# EAGLE design Battery_Monitor_5 (EAGLE 8.3.2)
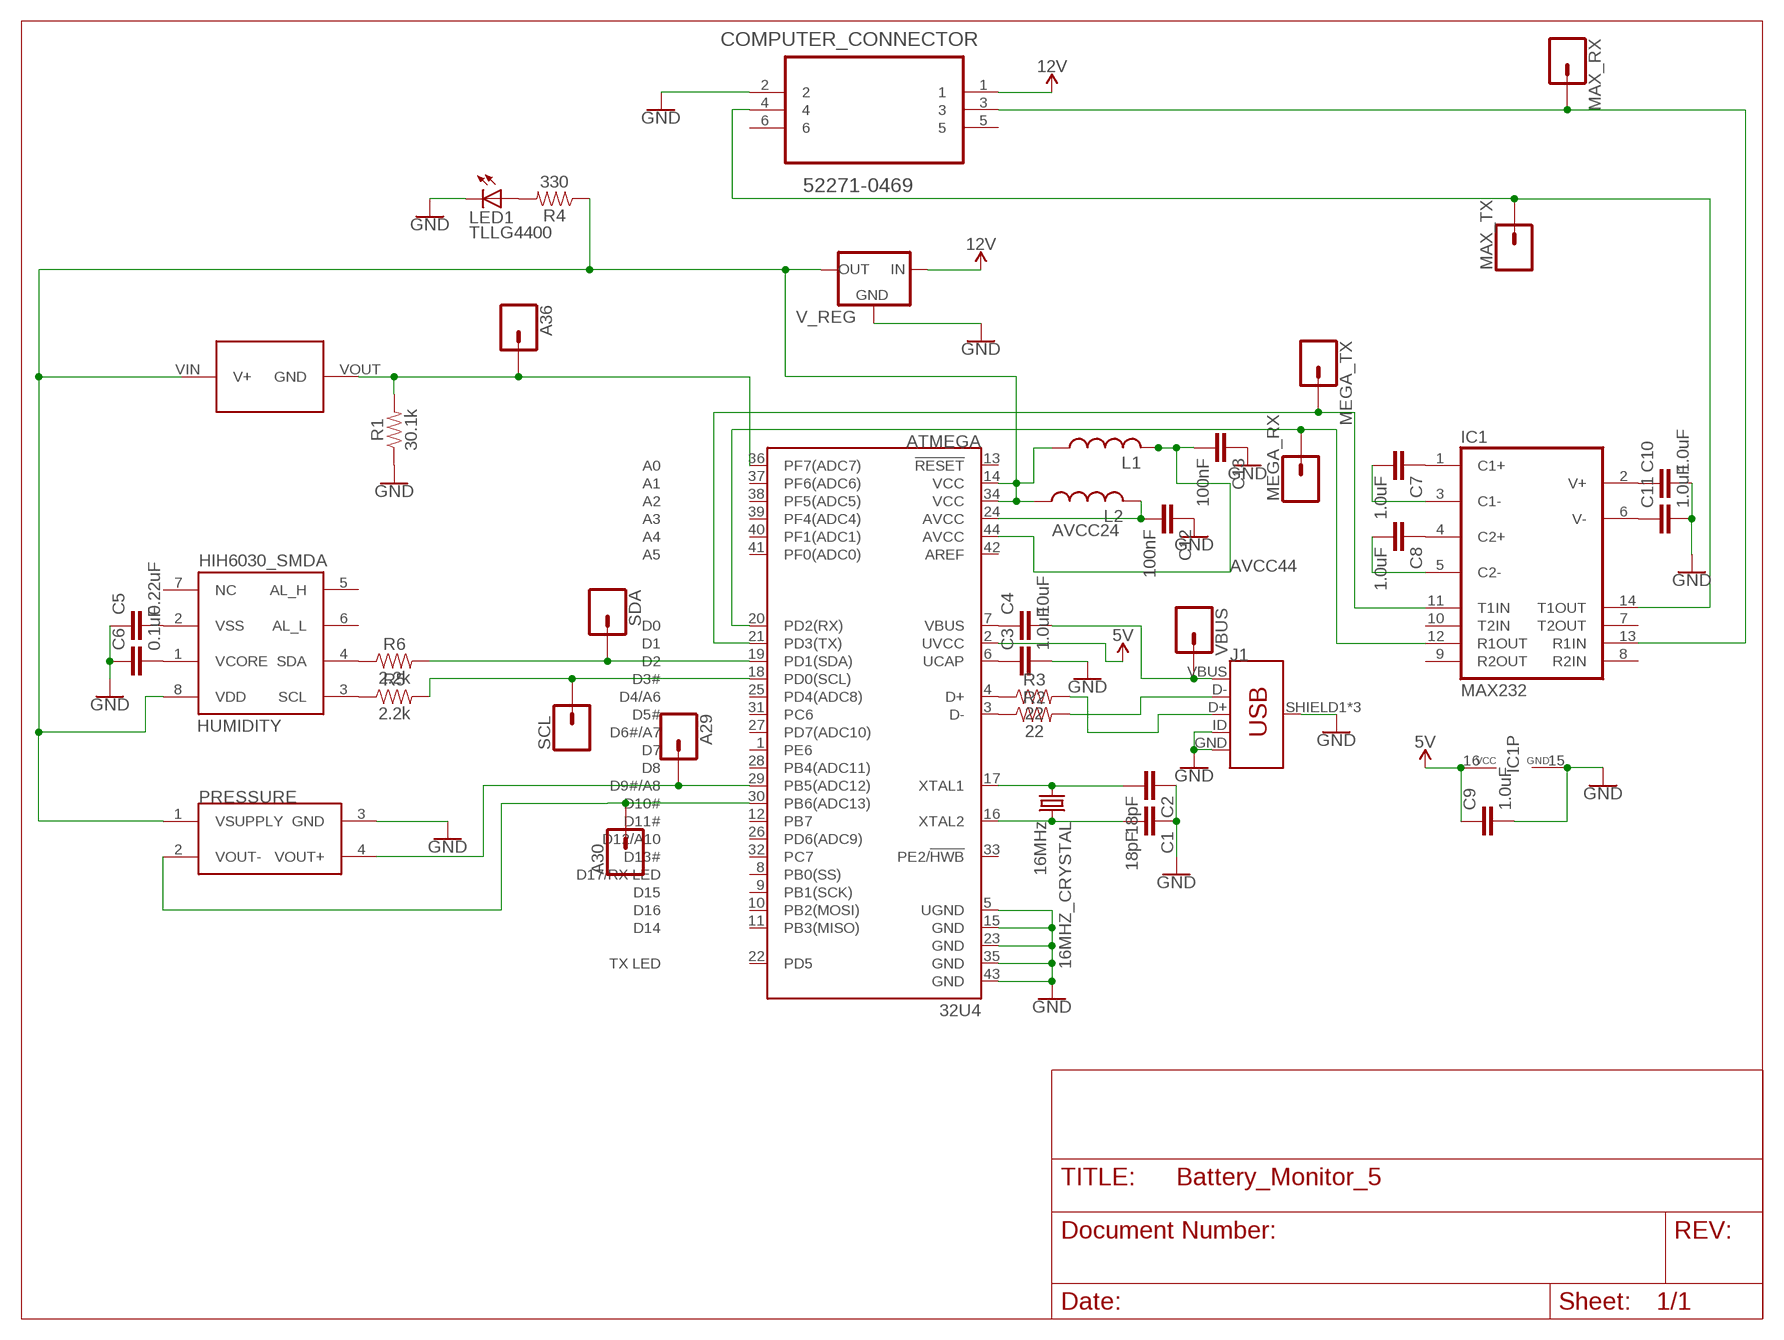
[diagram p0: schematic, sheet 1]

## Parts
16MHZ_CRYSTAL  16MHz  CRYSTALHC49S  [HC49/S]
A29  CONN_01POGOPIN_HOLE_LARGE  [1X01_POGOPIN_HOLE_0.061_DIA]
A30  CONN_01POGOPIN_HOLE_LARGE  [1X01_POGOPIN_HOLE_0.061_DIA]
A36  CONN_01POGOPIN_HOLE_LARGE  [1X01_POGOPIN_HOLE_0.061_DIA]
ATMEGA  32U4  ATMEGA32U4QFN  [QFN-44]
C1  18pF  18PF-0603-50V-5%  [0603]
C2  18pF  18PF-0603-50V-5%  [0603]
C3  1.0uF  1.0UF-0402-16V-10%  [0402]
C4  10uF  10UF-0603-6.3V-20%  [0603]
C5  0.22uF  0.22UF-0603-25V-10%  [0603]
C6  0.1uF  0.1UF-0402-16V-10%  [0402]
C7  1.0uF  1.0UF-0402-16V-10%  [0402]
C8  1.0uF  1.0UF-0402-16V-10%  [0402]
C9  1.0uF  1.0UF-0402-16V-10%  [0402]
C10  1.0uF  1.0UF-0402-16V-10%  [0402]
C11  1.0uF  1.0UF-0402-16V-10%  [0402]
C12  100nF  1.0UF-0402-16V-10%  [0402]
C13  100nF  1.0UF-0402-16V-10%  [0402]
COMPUTER_CONNECTOR  52271-0469  [MOLEX_52271-0469]
FLEX_SQ  MOLEX_2WIRE2018  [SMT_MOLEX_PKG]
HUMIDITY  HIH6030_SMDA  [SMD-8]
IC1  MAX232  [DIL16]
J1  USB_MICRO-B_FEMALE-SMT  [USB-B-MICRO-SMD]
L1  L-USL1812  [L1812]
L2  L-USL1812  [L1812]
LED1  TLLG4400  [LED3MM]
MAX_RX  CONN_01POGOPIN_HOLE_LARGE  [1X01_POGOPIN_HOLE_0.061_DIA]
MAX_TX  CONN_01POGOPIN_HOLE_LARGE  [1X01_POGOPIN_HOLE_0.061_DIA]
MEGA_RX  CONN_01POGOPIN_HOLE_LARGE  [1X01_POGOPIN_HOLE_0.061_DIA]
MEGA_TX  CONN_01POGOPIN_HOLE_LARGE  [1X01_POGOPIN_HOLE_0.061_DIA]
PRESSURE  HONEYWELL_PRESSURE_SENSOR2018  [4PIN_SMT]
R1  30.1k  30.1KOHM-0603-1/10W-1%  [0603]
R2  22  22OHM-0402-1/10W-1%  [0402]
R3  22  22OHM-0402-1/10W-1%  [0402]
R4  330  330OHM-0603-1/10W-1%  [0603]
R5  2.2k  2.2KOHM-0603-1/10W-1%  [0603]
R6  2.2k  2.2KOHM-0603-1/10W-1%  [0603]
SCL  CONN_01POGOPIN_HOLE_LARGE  [1X01_POGOPIN_HOLE_0.061_DIA]
SDA  CONN_01POGOPIN_HOLE_LARGE  [1X01_POGOPIN_HOLE_0.061_DIA]
V_REG  DC_DC_78XXA  [DC-DC_CONVERTER_78XX]
VBUS  CONN_01POGOPIN_HOLE_LARGE  [1X01_POGOPIN_HOLE_0.061_DIA]

## Nets
5V: ATMEGA.2(UVCC) ATMEGA.14(VCC) ATMEGA.34(VCC) C9.1 FLEX_SQ.VIN(V+) HUMIDITY.8(VDD) IC1.16(VCC) L1.1 L2.1 PRESSURE.1(VSUPPLY) R4.1 V_REG.VOUT(OUT)
12V: COMPUTER_CONNECTOR.1 V_REG.VIN(IN)
A29: A29.1 ATMEGA.29(PB5(ADC12)) PRESSURE.4(VOUT+)
A30: A30.1 ATMEGA.30(PB6(ADC13)) PRESSURE.2(VOUT-)
A36: A36.1 ATMEGA.36(PF7(ADC7)) FLEX_SQ.VOUT(GND) R1.2
AVCC24: ATMEGA.24(AVCC) C12.2 L2.2
AVCC44: ATMEGA.44(AVCC) C13.2 L1.2
D+: J1.D+ R3.2
D-: J1.D- R2.2
GND: ATMEGA.5(UGND) ATMEGA.15(GND) ATMEGA.23(GND) ATMEGA.35(GND) ATMEGA.43(GND) C1.1 C2.1 C3.2 C5.1 C6.1 C9.2 C10.2 C11.2 C12.1 C13.1 COMPUTER_CONNECTOR.2 IC1.15(GND) J1.GND J1.ID J1.SHIELD1(SHIELD) J1.SHIELD2(SHIELD) J1.SHIELD3(SHIELD) LED1.K(C) PRESSURE.3(GND) R1.1 V_REG.GND
MAX_RX: COMPUTER_CONNECTOR.3 IC1.13(R1IN) MAX_RX.1
MAX_TX: COMPUTER_CONNECTOR.4 IC1.14(T1OUT) MAX_TX.1
MEGA_RX: ATMEGA.20(PD2(RX)) IC1.12(R1OUT) MEGA_RX.1
MEGA_TX: ATMEGA.21(PD3(TX)) IC1.11(T1IN) MEGA_TX.1
N$3: HUMIDITY.3(SCL) R5.1
N$5: HUMIDITY.4(SDA) R6.1
N$6: C6.2 HUMIDITY.1(VCORE)
N$7: C5.2 HUMIDITY.2(VSS)
N$8: C7.1 IC1.1(C1+)
N$9: C8.1 IC1.4(C2+)
N$10: C8.2 IC1.5(C2-)
N$11: C7.2 IC1.3(C1-)
N$14: C10.1 IC1.2(V+)
N$15: C11.1 IC1.6(V-)
N$19: ATMEGA.3(D-) R2.1
N$20: ATMEGA.4(D+) R3.1
N$21: ATMEGA.6(UCAP) C3.1
N$22: ATMEGA.7(VBUS) C4.1
N$23: LED1.A R4.2
SCL: ATMEGA.18(PD0(SCL)) R5.2 SCL.1
SDA: ATMEGA.19(PD1(SDA)) R6.2 SDA.1
TAL1: 16MHZ_CRYSTAL.1 ATMEGA.17(XTAL1) C2.2
TAL2: 16MHZ_CRYSTAL.2 ATMEGA.16(XTAL2) C1.2
VBUS: C4.2 J1.VBUS VBUS.1
Unconnected: ATMEGA.1(PE6) ATMEGA.8(PB0(SS)) ATMEGA.9(PB1(SCK)) ATMEGA.10(PB2(MOSI)) ATMEGA.11(PB3(MISO)) ATMEGA.12(PB7) ATMEGA.13(!RESET) ATMEGA.22(PD5) ATMEGA.25(PD4(ADC8)) ATMEGA.26(PD6(ADC9)) ATMEGA.27(PD7(ADC10)) ATMEGA.28(PB4(ADC11)) ATMEGA.31(PC6) ATMEGA.32(PC7) ATMEGA.33(PE2/!HWB) ATMEGA.37(PF6(ADC6)) ATMEGA.38(PF5(ADC5)) ATMEGA.39(PF4(ADC4)) ATMEGA.40(PF1(ADC1)) ATMEGA.41(PF0(ADC0)) ATMEGA.42(AREF) COMPUTER_CONNECTOR.5 COMPUTER_CONNECTOR.6 HUMIDITY.5(AL_H) HUMIDITY.6(AL_L) HUMIDITY.7(NC) IC1.7(T2OUT) IC1.8(R2IN) IC1.9(R2OUT) IC1.10(T2IN)

## Library data of the parts
16MHZ_CRYSTAL = crystal:CRYSTAL: CRYSTAL; OC_FARNELL: 1667008; OC_NEWARK: unknown
A29 A30 A36 MAX_RX MAX_TX MEGA_RX MEGA_TX SCL SDA VBUS = SparkFun-Connectors:CONN_01: Single connection point. Often used as Generic Header-pin footprint for 0.1 inch spaced/style header connections On any of the 0.1 inch spaced packages, you can populate with these: Break Away Headers - Straight <https://www.sparkfun.com/products/116> (PRT-00116) Break Away Male Headers - Right Angle <https://www.sparkfun.com/products/553> (PRT-00553) Female Headers <https://www.sparkfun.com/products/115> (PRT-00115) Break Away Headers - Machine Pin <https://www.sparkfun.com/products/117> (PRT-00117) Break Away Female Headers - Swiss Machine Pin <https://www.sparkfun.com/products/743> (PRT-00743) This device is also useful as a general connection point to wire up your design to another part of your project. Our various solder wires solder well into these plated through hole pads. Hook-Up Wire - Assortment (Stranded, 22 AWG) <https://www.sparkfun.com/products/11375> (PRT-11375) Hook-Up Wire - Assortment (Solid Core, 22 AWG) <https://www.sparkfun.com/products/11367> (PRT-11367) View the entire wire category on our website here <https://www.sparkfun.com/categories/141> Special notes: SMTSO-256-ET is a "flush mount" nut for a 4-40 screw. We mostly use this on specialty testbeds; it is a nice way to connect hardware to your PCB at an adjustable hieght. Also note, the SNAP packages are for using a snappable style connector. We sell a baggie of snaps and they are also used on two LilyPad designs: Snap Assortment - 30 pack (male and female) <https://www.sparkfun.com/products/11347> (DEV-11347) LilyPad Arduino SimpleSnap <https://www.sparkfun.com/products/10941> (DEV-10941) LilyPad SimpleSnap Protoboard <https://www.sparkfun.com/products/10940> (DEV-10940)
ATMEGA = SparkFun-IC-Microcontroller:ATMEGA32U4: Atmel MCU, 32KByte Atmel 44-pin 8-bit Microcontroller with 32KBytes of ISP Flash and USB Controller Datasheet <http://cdn.sparkfun.com/datasheets/Dev/Arduino/Boards/ATMega32U4.pdf> SparkFun Products LilyPad Arduino USB - ATmega32U4 Board <https://www.sparkfun.com/products/12049> (DEV-12049) Pro Micro - 5V/16MHz <https://www.sparkfun.com/products/12640> (DEV-12640) Pro Micro - 3.3V/8MHz <https://www.sparkfun.com/products/12587> (DEV-12587) Fio v3 - ATmega32U4 <https://www.sparkfun.com/products/11520> (DEV-11520) Qduino Mini <https://www.sparkfun.com/products/13614> (DEV-13614) Makey Makey - Standard Kit <https://www.sparkfun.com/products/11511> (WIG-11511) Makey Makey Deluxe Kit <https://www.sparkfun.com/products/11519> (WIG-11519); PROD_ID: IC-10828
C1 C2 = SparkFun-Capacitors:18PF: 18pF ceramic capacitors A capacitor is a passive two-terminal electrical component used to store electrical energy temporarily in an electric field.; PROD_ID: CAP-08267
C3 C7-C11 = SparkFun-Capacitors:1.0UF: 1µF ceramic capacitors A capacitor is a passive two-terminal electrical component used to store electrical energy temporarily in an electric field.; PROD_ID: CAP-12417
C4 = SparkFun-Capacitors:10UF: 10.0µF ceramic capacitors A capacitor is a passive two-terminal electrical component used to store electrical energy temporarily in an electric field.; PROD_ID: CAP-11015
C5 = SparkFun-Capacitors:0.22UF: 0.22µF ceramic capacitors A capacitor is a passive two-terminal electrical component used to store electrical energy temporarily in an electric field.; PROD_ID: CAP-07822
C6 = SparkFun-Capacitors:0.1UF: 0.1µF ceramic capacitors A capacitor is a passive two-terminal electrical component used to store electrical energy temporarily in an electric field.; PROD_ID: CAP-12416
C12 C13 = SparkFun-Capacitors:1.0UF: 1µF ceramic capacitors A capacitor is a passive two-terminal electrical component used to store electrical energy temporarily in an electric field.; PROD_ID: CAP-12417; VALUE: 1.0uF
COMPUTER_CONNECTOR = Molex_By_element14_Batch_1 (1):52271-0469: CONNECTOR, FPC, 1.0MM, 4 WAY; MPN: 52271-0469; OC_FARNELL: 1757086; OC_NEWARK: 07P8558; PACKAGE: CONNECTOR, FPC, 1.0MM, 4 WAY; SUPPLIER: Molex
FLEX_SQ = Molex_2wire_conn:MOLEX_2WIRE
HUMIDITY = Custom_Library:HIH6030_
IC1 = maxim:MAX232: RS232 TRANSCEIVER; MF: MAXIM; MPN: MAX232ACPE+; OC_FARNELL: 9723773; OC_NEWARK: 68K4544
J1 = SparkFun-Connectors:USB_MICRO-B: USB Type Micro-B Connector Male/female and PTH/SMT variants SparkFun Products: SparkFun microB USB Breakout <https://www.sparkfun.com/products/12035> SparkFun USB microB Plug Breakout <https://www.sparkfun.com/products/10031> SparkFun ESP8266 Thing <https://www.sparkfun.com/products/13231>; PROD_ID: CONN-11752
L1 L2 = rcl:L-US: INDUCTOR, American symbol
LED1 = led:TLLG4400: Low Current (2mA) LED 3 mm Tinted Diffused Package color GREEN Source: Data sheet <http://www.farnell.com/datasheets/391098.pdf>; MF: VISHAY SEMICONDUCTOR; OC_FARNELL: 1612435
PRESSURE = SMT_Pressure_library:HONEYWELL_PRESSURE_SENSOR
R1 = SparkFun-Resistors:30.1KOHM: 30.1kΩ resistor A resistor is a passive two-terminal electrical component that implements electrical resistance as a circuit element. Resistors act to reduce current flow, and, at the same time, act to lower voltage levels within circuits. - Wikipedia; PROD_ID: RES-08595
R2 R3 = SparkFun-Resistors:22OHM: 22Ω resistor A resistor is a passive two-terminal electrical component that implements electrical resistance as a circuit element. Resistors act to reduce current flow, and, at the same time, act to lower voltage levels within circuits. - Wikipedia; PROD_ID: RES-12427
R4 = SparkFun-Resistors:330OHM: 330Ω resistor A resistor is a passive two-terminal electrical component that implements electrical resistance as a circuit element. Resistors act to reduce current flow, and, at the same time, act to lower voltage levels within circuits. - Wikipedia; PROD_ID: RES-00818
R5 R6 = SparkFun-Resistors:2.2KOHM: 2.2kΩ resistor A resistor is a passive two-terminal electrical component that implements electrical resistance as a circuit element. Resistors act to reduce current flow, and, at the same time, act to lower voltage levels within circuits. - Wikipedia; PROD_ID: RES-08272
V_REG = SparkFun-IC-Power:DC_DC_78XX

## Board
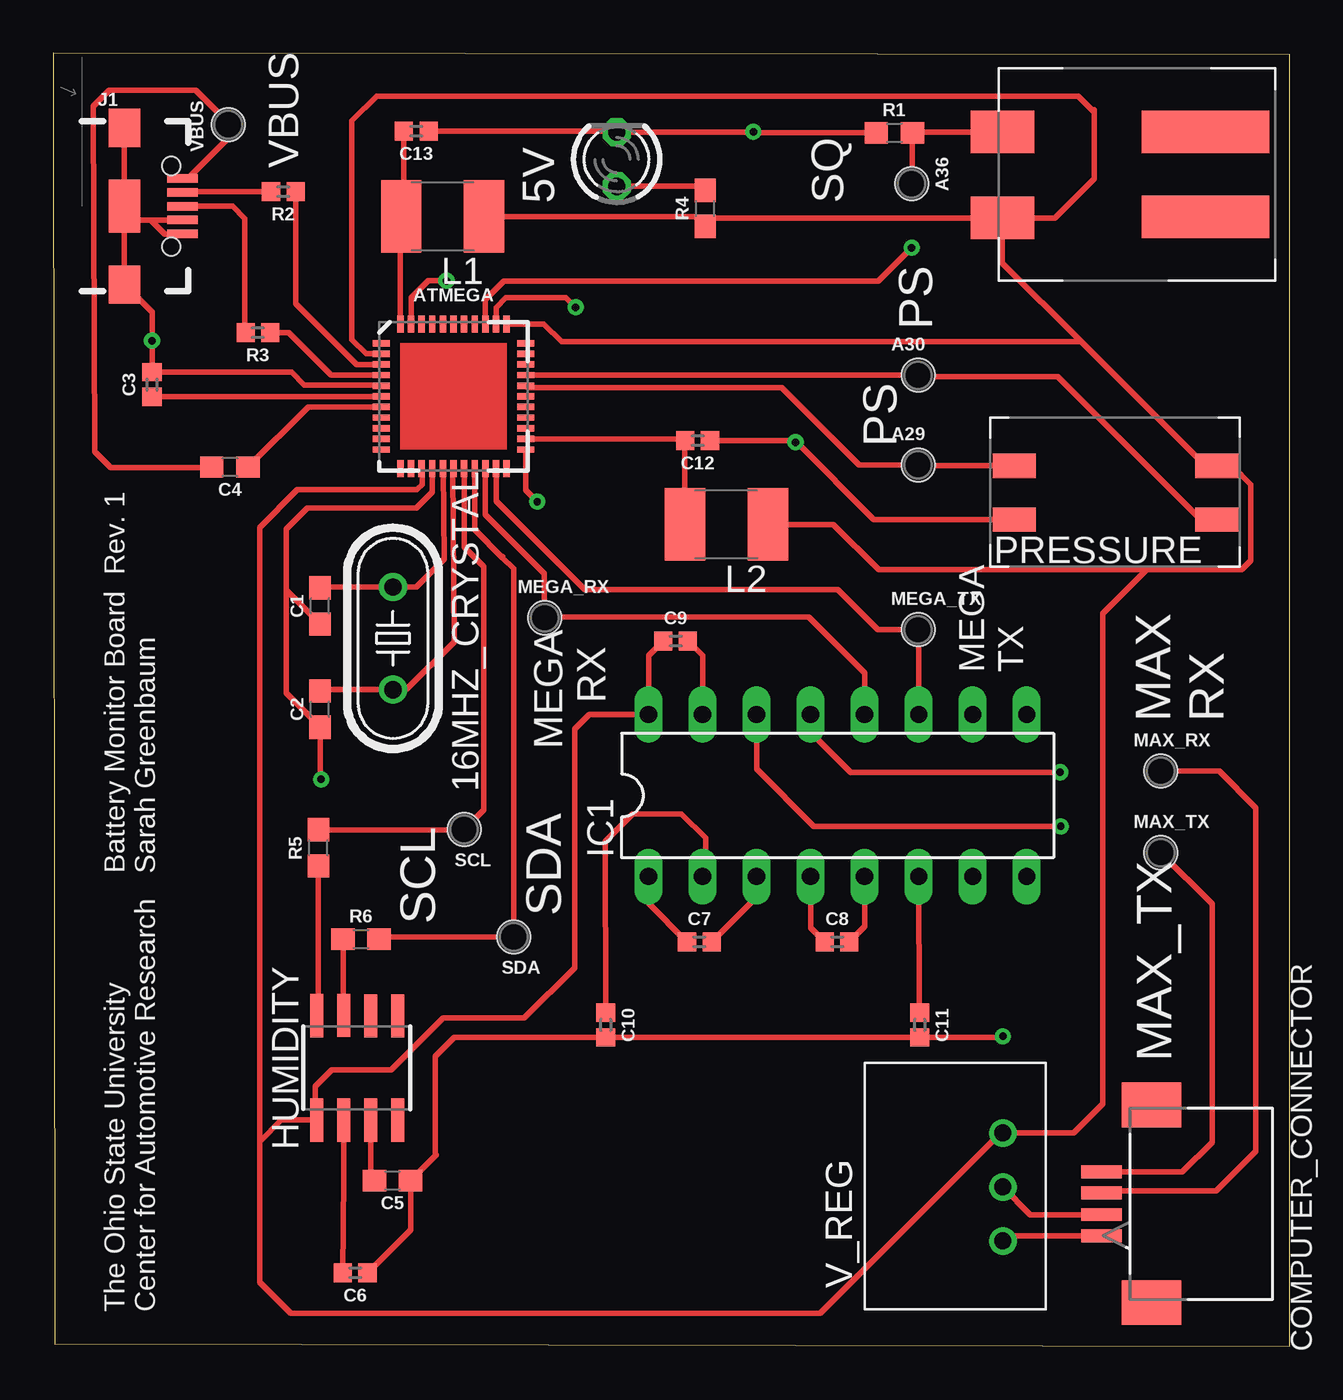
[diagram p1: board, top side]
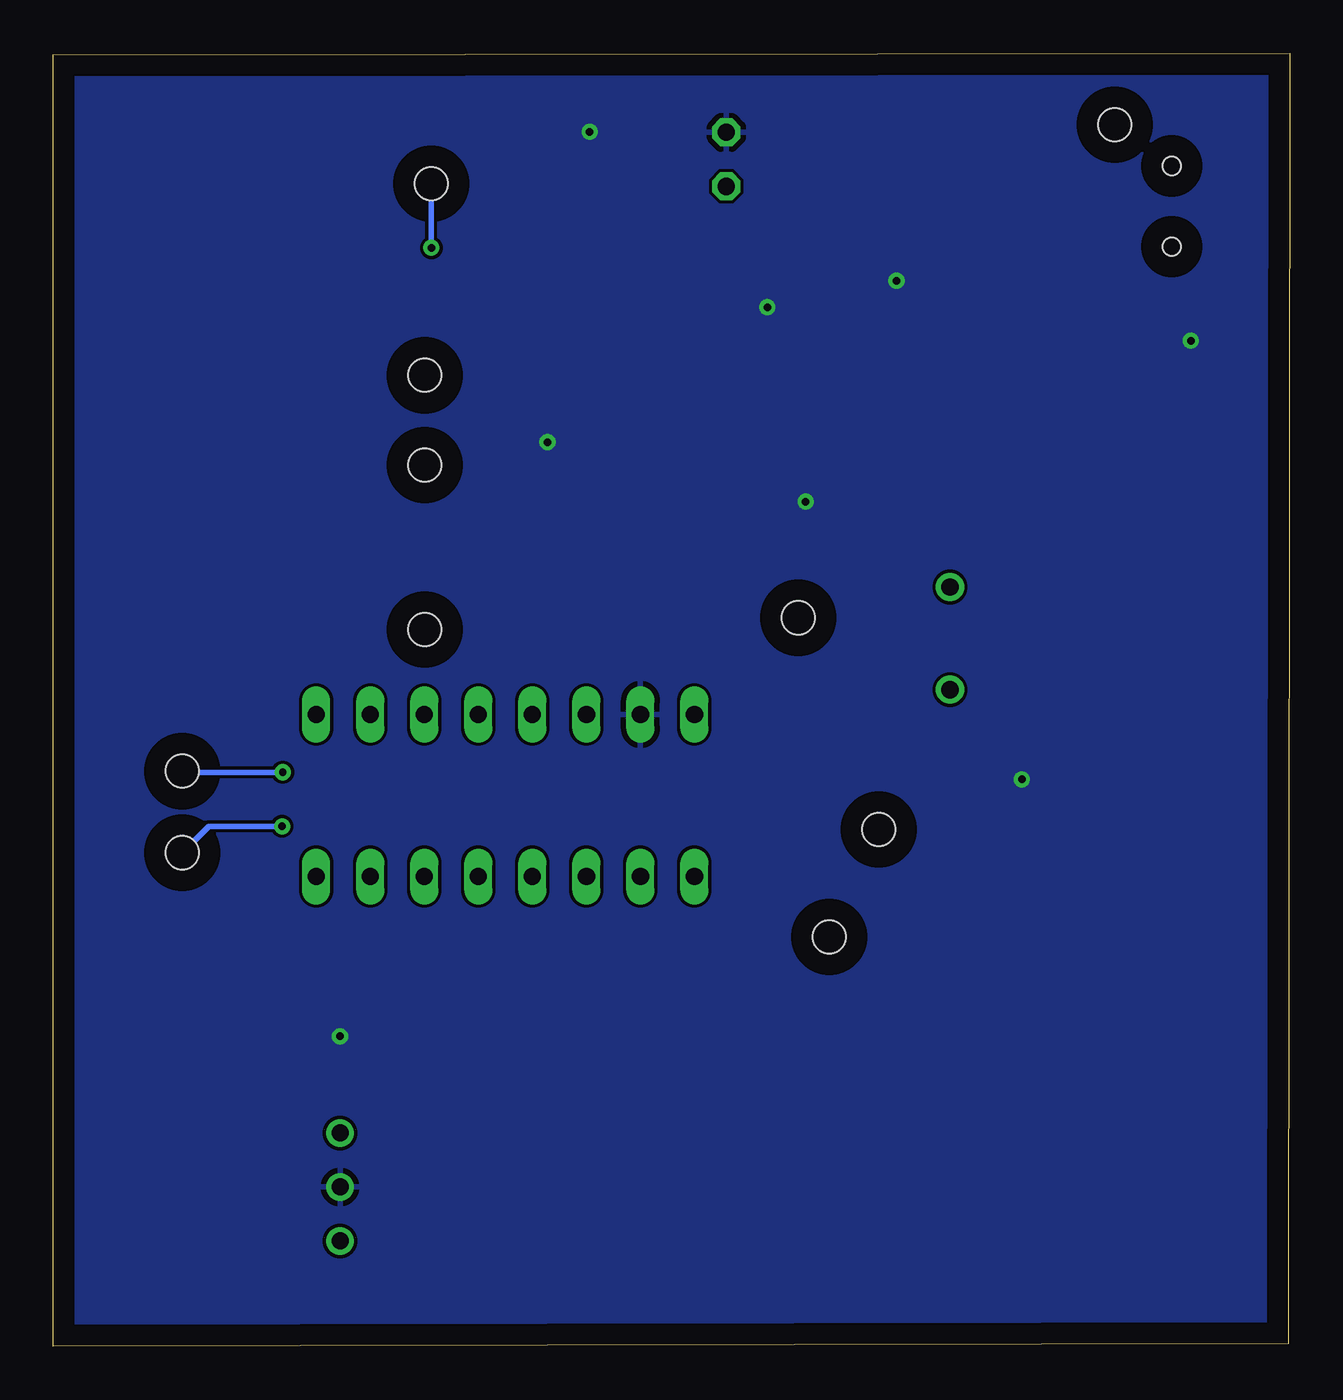
[diagram p2: board, bottom side, seen from below]

Size 58.14 x 60.82 mm. Coordinates in mm from the lower left corner, seen from the top.
Outline: 0.08,0.13 58.14,0 58.14,60.75 0,60.82 0.08,0.13
Copper layers (1*16): Top 0.035mm / dielectric 1.5mm / Bottom 0.035mm
Design rules "default": minimum track width 6mil, minimum drill 0.35mm, track to track 6mil, track to pad 6mil, pad to pad 6mil, via to via 6mil, smd to smd 6mil, copper to edge 40mil, drill to drill 6mil, minimum pad ring 10mil, minimum via ring 8mil, stop-mask expansion 4mil, vias tented up to drill 0mil, thermal gap 10mil

### Footprints (pad centres in the part's own frame; a part is rotated, then mirrored left to right if it is on the bottom)
HC49/S = drill 0.813: 1 -2.413,0; 2 2.413,0
1X01_POGOPIN_HOLE_0.061_DIA = drill 0.9 pad 0.813: 1 0,0 | hole 1.549: 0,0
QFN-44 = smd 0.8 x 0.3: 1 -3.4,2.5; 2 -3.4,2; 3 -3.4,1.5; 4 -3.4,1; 5 -3.4,0.5; 6 -3.4,0; 7 -3.4,-0.5; 8 -3.4,-1; 9 -3.4,-1.5; 10 -3.4,-2; 11 -3.4,-2.5; 23 3.4,-2.5; 24 3.4,-2; 25 3.4,-1.5; 26 3.4,-1; 27 3.4,-0.5; 28 3.4,0; 29 3.4,0.5; 30 3.4,1; 31 3.4,1.5; 32 3.4,2; 33 3.4,2.5 | smd 0.3 x 0.8: 12 -2.5,-3.4; 13 -2,-3.4; 14 -1.5,-3.4; 15 -1,-3.4; 16 -0.5,-3.4; 17 0,-3.4; 18 0.5,-3.4; 19 1,-3.4; 20 1.5,-3.4; 21 2,-3.4; 22 2.5,-3.4; 34 2.5,3.4; 35 2,3.4; 36 1.5,3.4; 37 1,3.4; 38 0.5,3.4; 39 0,3.4; 40 -0.5,3.4; 41 -1,3.4; 42 -1.5,3.4; 43 -2,3.4; 44 -2.5,3.4
0603 = smd 1.1 x 1: 1 -0.85,0; 2 0.85,0
0402 = smd 0.85 x 0.9: 1 -0.58,0; 2 0.58,0
MOLEX_52271-0469 = smd 0.61 x 1.905: 1 1.499,4.699; 2 0.508,4.699; 3 -0.508,4.699; 4 -1.499,4.699 | smd 2.108 x 2.794: 5 -4.648,7.061; 6 4.648,7.061
SMT_MOLEX_PKG = smd 6 x 2: NA 4.27,1; NONE 4.27,5 | smd 3 x 2: VIN 13.81,5.05; VOUT 13.81,1
SMD-8 = smd 0.61 x 2.03: 1 1.27,0; 2 2.54,0; 3 -0.01,4.91; 4 1.27,4.92; 5 2.54,4.9; 6 3.8,4.9; 7 3.81,0; 8 0,0
DIL16 = drill 0.813 long: 1 -8.89,-3.81; 2 -6.35,-3.81; 3 -3.81,-3.81; 4 -1.27,-3.81; 5 1.27,-3.81; 6 3.81,-3.81; 7 6.35,-3.81; 8 8.89,-3.81; 9 8.89,3.81; 10 6.35,3.81; 11 3.81,3.81; 12 1.27,3.81; 13 -1.27,3.81; 14 -3.81,3.81; 15 -6.35,3.81; 16 -8.89,3.81
USB-B-MICRO-SMD = smd 1.45 x 0.4: D+ 2.725,0; D- 2.725,0.65; GND 2.725,-1.3; ID 2.725,-0.65; VBUS 2.725,1.3 | smd 1.5 x 1.8: SHIELD1 0,3.685; SHIELD2 0,-3.685 | smd 1.5 x 2.5: SHIELD3 0,0 | hole 0.85: 2.2,1.9; 2.2,-1.9
L1812 = smd 1.9 x 3.4: 1 -1.95,0; 2 1.95,0
LED3MM = drill 0.813 octagon: A -1.27,0; K 1.27,0
4PIN_SMT = smd 1.143 x 2.032: 1 3.09,-1.01; 2 0.56,-1.01; 3 0.56,8.51; 4 3.09,8.51
DC-DC_CONVERTER_78XX = drill 0.8: GND 0,0; VIN -2.54,0; VOUT 2.54,0

### Placement (x,y rotation side)
16MHZ_CRYSTAL  15.98,33.3 90 top
A29  40.67,41.45 0 top
A30  40.67,45.67 0 top
A36  40.36,54.69 270 top
ATMEGA  18.82,44.68 0 top
C1  12.55,34.82 90 top
C2  12.55,29.97 90 top
C3  4.65,45.24 90 top
C4  8.31,41.35 180 top
C5  15.95,7.8 180 top
C6  14.2,3.45 180 top
C7  30.38,19.02 0 top
C8  36.86,19.02 0 top
C9  29.26,33.17 0 top
C10  25.98,15.11 270 top
C11  40.74,15.11 270 top
C12  30.3,42.6 180 top
C13  17.07,57.15 180 top
COMPUTER_CONNECTOR  44.58,6.71 270 top
FLEX_SQ  58.45,58.12 180 top
HUMIDITY  12.4,10.64 0 top
IC1  36.88,25.91 0 top
J1  3.35,53.62 0 top
L1  18.31,53.14 180 top
L2  31.65,38.66 180 top
LED1  26.49,55.83 90 top
MAX_RX  52.07,27.05 0 top
MAX_TX  52.07,23.22 0 top
MEGA_RX  23.11,34.26 0 top
MEGA_TX  40.67,33.71 0 top
PRESSURE  53.7,38.33 90 top
R1  39.55,57.07 0 top
R2  10.82,54.31 180 top
R3  9.63,47.68 180 top
R4  30.66,53.52 90 top
R5  12.47,23.44 90 top
R6  14.48,19.15 0 top
SCL  19.32,24.31 180 top
SDA  21.65,19.25 180 top
V_REG  44.65,7.49 90 top
VBUS  8.23,57.45 90 top

### Tracks (layer width: path | path; a pad name or v marks a point on that pad's centre or on a via)
5V
  Top 0.254: 44.7,10.01 V_REG.VOUT | C9.1 27.99,32.48 IC1.16 25.2,29.72 24.51,29.03 24.51,17.81 22.15,15.44 18.34,15.44 15.9,13 13.11,13 12.32,12.22 12.32,10.72 HUMIDITY.8 10.72,10.64 9.7,9.63 | FLEX_SQ.VIN 31.05,53.07 R4.1 30.19,53.14 L1.1 | PRESSURE.1 54.16,41.42 48.34,47.24 | 48.34,47.24 44.63,50.95 FLEX_SQ.VIN | V_REG.VOUT 44.48,10.03 | L2.1 36.68,38.66 38.81,36.53 51.41,36.53 | 51.41,36.53 55.88,36.53 56.31,36.96 56.31,40.54 55.43,41.42 PRESSURE.1 | 54.75,41.38 PRESSURE.1 | V_REG.VOUT 44.55,10.03 36.07,1.55 11.18,1.55 9.7,3.02 9.7,9.63 | ATMEGA.34 23.07,48.08 23.9,47.24 48.34,47.24 | ATMEGA.2 14.71,46.68 14.05,47.35 14.05,57.63 15.21,58.8 48.18,58.8 48.95,58.04 | FLEX_SQ.VIN 47.1,53.07 48.95,54.91 48.95,58.04 | 48.95,58.04 48.95,58.17 | 9.7,9.63 9.7,38.51 11.48,40.28 17.09,40.28 17.35,40.54 17.35,41.25 ATMEGA.14 | V_REG.VOUT 47.98,10.03 49.35,11.4 49.35,34.47 51.41,36.53
12V
  Top 0.254: 49.1,5.03 COMPUTER_CONNECTOR.1 44.91,5.21 V_REG.VIN
A29
  Top 0.254: PRESSURE.4 40.7,41.42 A29.1 37.9,41.45 34.27,45.09 22.32,45.09 ATMEGA.29
A30
  Top 0.254: ATMEGA.30 40.66,45.68 A30.1 40.72,45.62 47.22,45.62 53.95,38.89 PRESSURE.2
A36  (via drill 0.35)
  Top 0.254: 44,57.88 FLEX_SQ.VOUT 40.44,57.12 R1.2 40.4,54.72 A36.1 | ATMEGA.36 20.32,49.23 21.18,50.09 38.79,50.09 v40.36,51.66
  Bottom 0.254: v40.36,51.66 A36.1
AVCC24
  Top 0.254: L2.2 29.7,42.57 C12.2 29.64,42.68 ATMEGA.24
AVCC44
  Top 0.254: 16.39,53.01 16.51,52.52 16.32,52.33 ATMEGA.44 | 16.39,53.01 L1.2 | C13.2 16.49,53.11 16.39,53.01
D+
  Top 0.254: 6.07,53.59 6.1,53.59 J1.D+ 8.43,53.62 9.02,53.04 9.02,47.71 R3.2
D-
  Top 0.254: R2.2 6.11,54.31 J1.D-
GND  (via drill 0.35)
  Top 0.254: IC1.15 30.53,32.48 C9.2 | COMPUTER_CONNECTOR.2 45.95,6.2 V_REG.GND | J1.SHIELD1 J1.SHIELD3 | ATMEGA.23 22.22,40.26 v22.76,39.73 | 10.95,35.57 10.95,38.43 11.94,39.42 17.07,39.42 17.82,40.17 ATMEGA.15 | 10.95,35.57 C1.1 | 10.95,35.57 10.95,30.72 C2.1 12.55,26.72 v12.6,26.67 | ATMEGA.5 15.39,45.21 11.81,45.21 11.21,45.82 C3.2 v4.65,47.29 4.65,48.64 J1.SHIELD2 J1.SHIELD3 | 4.6,52.97 J1.ID | 4.6,52.97 4,52.97 J1.SHIELD3 | J1.GND 5.25,52.32 4.6,52.97 | LED1.K 26.52,57.07 | R1.1 32.97,57.07 32.94,57.1 | 32.94,57.1 v32.92,57.12 | LED1.K 32.94,57.1 | ATMEGA.35 20.82,48.86 21.29,49.33 24.11,49.33 v24.56,48.87 | PRESSURE.3 38.58,38.89 34.95,42.52 v34.9,42.52 34.82,42.6 C12.1 30.91,42.57 | v44.65,14.58 44.61,14.53 C11.2 C10.2 18.85,14.53 17.96,13.64 17.96,8.95 | C6.1 16.8,5.48 C5.1 17.96,8.95 | 17.96,8.95 18.01,9.01 | C13.1 26.44,57.15 LED1.K | v18.49,50.11 17.63,50.11 16.84,49.33 16.84,48.1 ATMEGA.43
  pour Bottom: 0.36,60.41 0.26,0.52 57.6,0.49 57.67,60.41
MAX_RX  (via drill 0.35)
  Top 0.254: IC1.13 35.61,28.88 37.49,27 v47.35,27 | MAX_RX.1 54.81,27.05 56.54,25.32 56.54,9.17 54.69,7.32 49.38,7.32 COMPUTER_CONNECTOR.3
  Bottom 0.254: v47.35,27 52.02,27 MAX_RX.1
MAX_TX  (via drill 0.35)
  Top 0.254: IC1.14 33.07,27.15 35.76,24.46 v47.37,24.46 | COMPUTER_CONNECTOR.4 53.09,8.2 54.48,9.6 54.48,20.8 MAX_TX.1
  Bottom 0.254: v47.37,24.46 50.83,24.46 MAX_TX.1
MEGA_RX
  Top 0.254: 38.1,29.77 IC1.12 38.15,31.67 35.54,34.29 23.14,34.29 MEGA_RX.1 23.09,34.29 23.09,36.35 20.32,39.11 ATMEGA.20
MEGA_TX
  Top 0.254: IC1.11 40.69,33.68 MEGA_TX.1 38.76,33.71 36.88,35.59 24.99,35.59 20.83,39.75 ATMEGA.21
N$3
  Top 0.254: R5.1 12.47,15.64 HUMIDITY.3
N$5
  Top 0.254: R6.1 13.63,15.6 HUMIDITY.4
N$6
  Top 0.254: HUMIDITY.1 13.66,7.93 C6.2
N$7
  Top 0.254: HUMIDITY.2 14.94,7.96 C5.2
N$8
  Top 0.254: IC1.1 27.99,20.83 C7.1
N$9
  Top 0.254: IC1.4 35.61,19.69 C8.1
N$10
  Top 0.254: IC1.5 38.15,19.74 C8.2
N$11
  Top 0.254: IC1.3 33.07,21.14 C7.2
N$14
  Top 0.254: C10.1 25.96,23.75 27.25,25.04 29.54,25.04 30.68,23.9 30.68,22.25 IC1.2
N$15
  Top 0.254: IC1.6 40.72,15.72 C11.1
N$19
  Top 0.254: ATMEGA.3 14.27,46.18 11.4,49.05 R2.1
N$20
  Top 0.254: ATMEGA.4 13.07,45.68 11.07,47.68 R3.1
N$21
  Top 0.254: C3.1 4.68,44.68 ATMEGA.6
N$22
  Top 0.254: ATMEGA.7 11.98,44.18 C4.1
N$23
  Top 0.254: R4.2 30.66,54.56 LED1.A
SCL
  Top 0.254: R5.2 19.31,24.29 SCL.1 20.24,25.23 20.24,36.68 19.32,37.6 ATMEGA.18
SDA
  Top 0.254: 21.14,37.08 21.14,37.15 | 21.14,37.08 19.82,38.4 ATMEGA.19 | 21.14,37.08 21.65,36.58 SDA.1 15.43,19.25 R6.2
TAL1
  Top 0.254: ATMEGA.17 18.8,41.25 18.85,33.12 16.61,30.89 16MHZ_CRYSTAL.1 12.61,30.89 C2.2
TAL2
  Top 0.254: ATMEGA.16 18.34,41.26 18.39,37.03 17.07,35.71 16MHZ_CRYSTAL.2 12.59,35.71 C1.2
VBUS
  Top 0.254: J1.VBUS 6.1,54.94 6.35,54.94 8.23,56.82 VBUS.1 8.23,57.56 6.71,59.08 2.64,59.08 1.88,58.32 1.96,42.09 2.72,41.33 7.43,41.33 C4.2

### Text on the board
tPlace: VBUS | 5V | SQ | PS | PS | MEGA / TX | MAX / RX | MEGA / RX | Battery Monitor Board Rev. 1 / Sarah Greenbaum | SDA | SCL | MAX_TX | The Ohio State University / Center for Automotive Research